# Altium schematic sheet main.SchDoc
size A4; PageSetup: Record=PageOptions|CenterHorizontal=True|CenterVertical=True|PrintScale=0.97|XCorrection=1.00|YCorrection=1.00|PrintKind=0|BorderSize=5000000|LeftOffset=0|BottomOffset=0|Orientation=2|PaperLength=1000|PaperWidth=1000|Scale=100|PaperSource=273|PrintQuality=-2|MediaType=1|DitherType=10|PaperKind=A4|PrintScaleMode=1; Organization: Altium Limited; Address1: 3 Minna Close; Address2: Belrose; Address3: NSW 2085; Address4: Australia
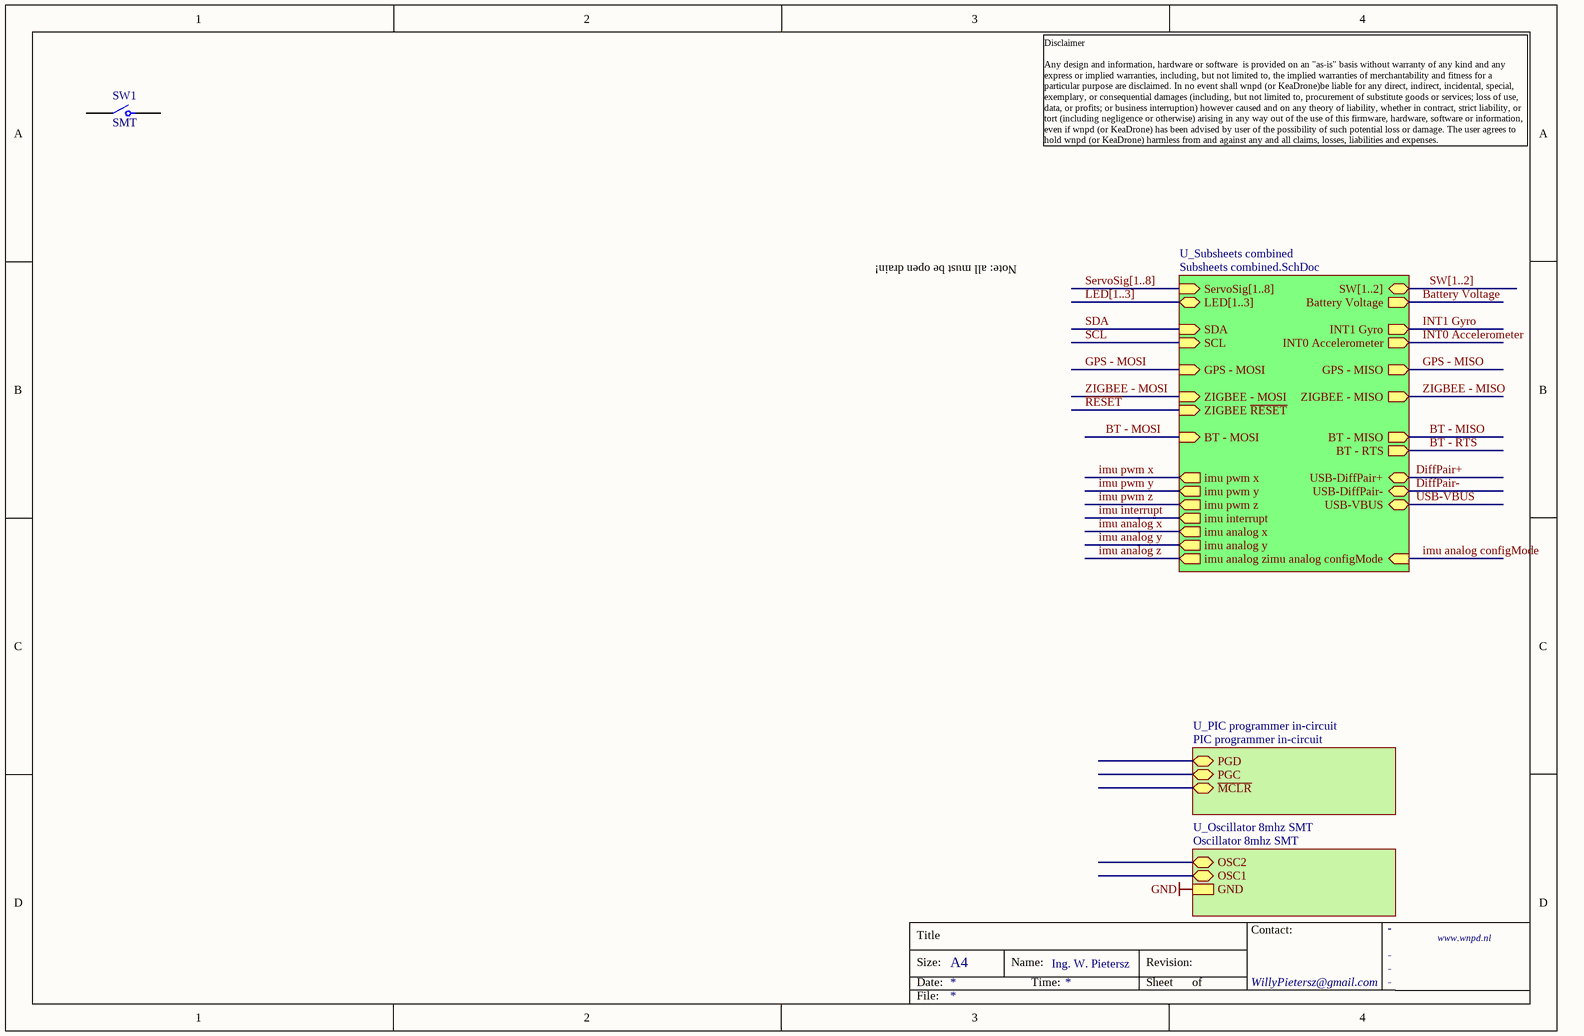
[diagram p0: main.SchDoc]

## Parts
SW1  SMT  [SWITCH TACT]

## Sub-sheets
U_Oscillator 8mhz SMT = Oscillator 8mhz SMT: OSC2 (bidir), OSC1 (bidir), GND
U_PIC programmer in-circuit = PIC programmer in-circuit: PGD (bidir), PGC (bidir), ~{MCLR} (bidir)
U_Subsheets combined = Subsheets combined.SchDoc: ServoSig[1..8], INT0 Accelerometer (out), INT1 Gyro (out), ZIGBEE - MISO (out), ZIGBEE - MOSI (in), ZIGBEE ~{RESET} (in), SDA (in), SCL (in), Battery Voltage (out), GPS - MISO (out), GPS - MOSI (in), USB-DiffPair+, USB-DiffPair-, USB-VBUS, LED[1..3] (bidir), SW[1..2], BT - MISO (out), BT - MOSI (in), BT - RTS (out), imu pwm x (out), imu pwm y (out), imu pwm z (out), imu interrupt (out), imu analog x (out), imu analog y (out), imu analog z (out), imu analog configMode (in)

## Nets
GND: sheet U_Oscillator 8mhz SMT/GND
Battery Voltage: sheet U_Subsheets combined/Battery Voltage
BT - MISO: sheet U_Subsheets combined/BT - MISO
BT - MOSI: sheet U_Subsheets combined/BT - MOSI
BT - RTS: sheet U_Subsheets combined/BT - RTS
DiffPair+: sheet U_Subsheets combined/USB-DiffPair+
DiffPair-: sheet U_Subsheets combined/USB-DiffPair-
GPS - MISO: sheet U_Subsheets combined/GPS - MISO
GPS - MOSI: sheet U_Subsheets combined/GPS - MOSI
imu analog configMode: sheet U_Subsheets combined/imu analog configMode
imu analog x: sheet U_Subsheets combined/imu analog x
imu analog y: sheet U_Subsheets combined/imu analog y
imu analog z: sheet U_Subsheets combined/imu analog z
imu interrupt: sheet U_Subsheets combined/imu interrupt
imu pwm x: sheet U_Subsheets combined/imu pwm x
imu pwm y: sheet U_Subsheets combined/imu pwm y
imu pwm z: sheet U_Subsheets combined/imu pwm z
INT0 Accelerometer: sheet U_Subsheets combined/INT0 Accelerometer
INT1 Gyro: sheet U_Subsheets combined/INT1 Gyro
~{RESET}: sheet U_Subsheets combined/ZIGBEE ~{RESET}
SCL: sheet U_Subsheets combined/SCL
SDA: sheet U_Subsheets combined/SDA
USB-VBUS: sheet U_Subsheets combined/USB-VBUS
ZIGBEE - MISO: sheet U_Subsheets combined/ZIGBEE - MISO
ZIGBEE - MOSI: sheet U_Subsheets combined/ZIGBEE - MOSI
NetSW1_1: SW1.1 SW1.4
NetSW1_2: SW1.2 SW1.3

## Buses and harness runs
bus LED[1..3] = sheet U_Subsheets combined/LED[1..3]
bus ServoSig[1..8] = sheet U_Subsheets combined/ServoSig[1..8]
bus SW[1..2] = sheet U_Subsheets combined/SW[1..2]

## Notes on the sheet
- Note: all must be open drain!
- Disclaimer
  Any design and information, hardware or software  is provided on an "as-is" basis without warranty of any kind and any express or implied warranties, including, but not limited to, the implied warranties of merchantability and fitness for a particular purpose are disclaimed. In no event shall wnpd (or KeaDrone)be liable for any direct, indirect, incidental, special, exemplary, or consequential damages (including, but not limited to, procurement of substitute goods or services; loss of use, data, or profits; or business interruption) however caused and on any theory of liability, whether in contract, strict liability, or tort (including negligence or otherwise) arising in any way out of the use of this firmware, hardware, software or information, even if wnpd (or KeaDrone) has been advised by user of the possibility of such potential loss or damage. The user agrees to hold wnpd (or KeaDrone) harmless from and against any and all claims, losses, liabilities and expenses.
- Title
- Size:
- Date:
- A4
- Name:
- Time:
- Ing. W. Pietersz
- Revision:
- Sheet
- of
- WillyPietersz@gmail.com
- Contact:
- -
- www.wnpd.nl
- File:

## Library data of the parts
SW1 = Pushbutton TACT: Switch; Current: 0.1; Voltage: 42; LatestRevision Note: Initial Release; Part Number: Pushbutton TACT; Component Type: Switch; LatestRevision Date: 4-10-2010; Author: Willem Pietersz; Supplier 2: Farnell; Supplier Part Number 2: 1795335; Number Of Pins: 4